# Altium project ST1-1.PrjPcb (part 3 of 5)

## Sheet Output_Terminals.SchDoc: Output Terminals & Voltage detection
size A3; DocumentNumber: 9; SheetNumber: 9; SheetTotal: 20
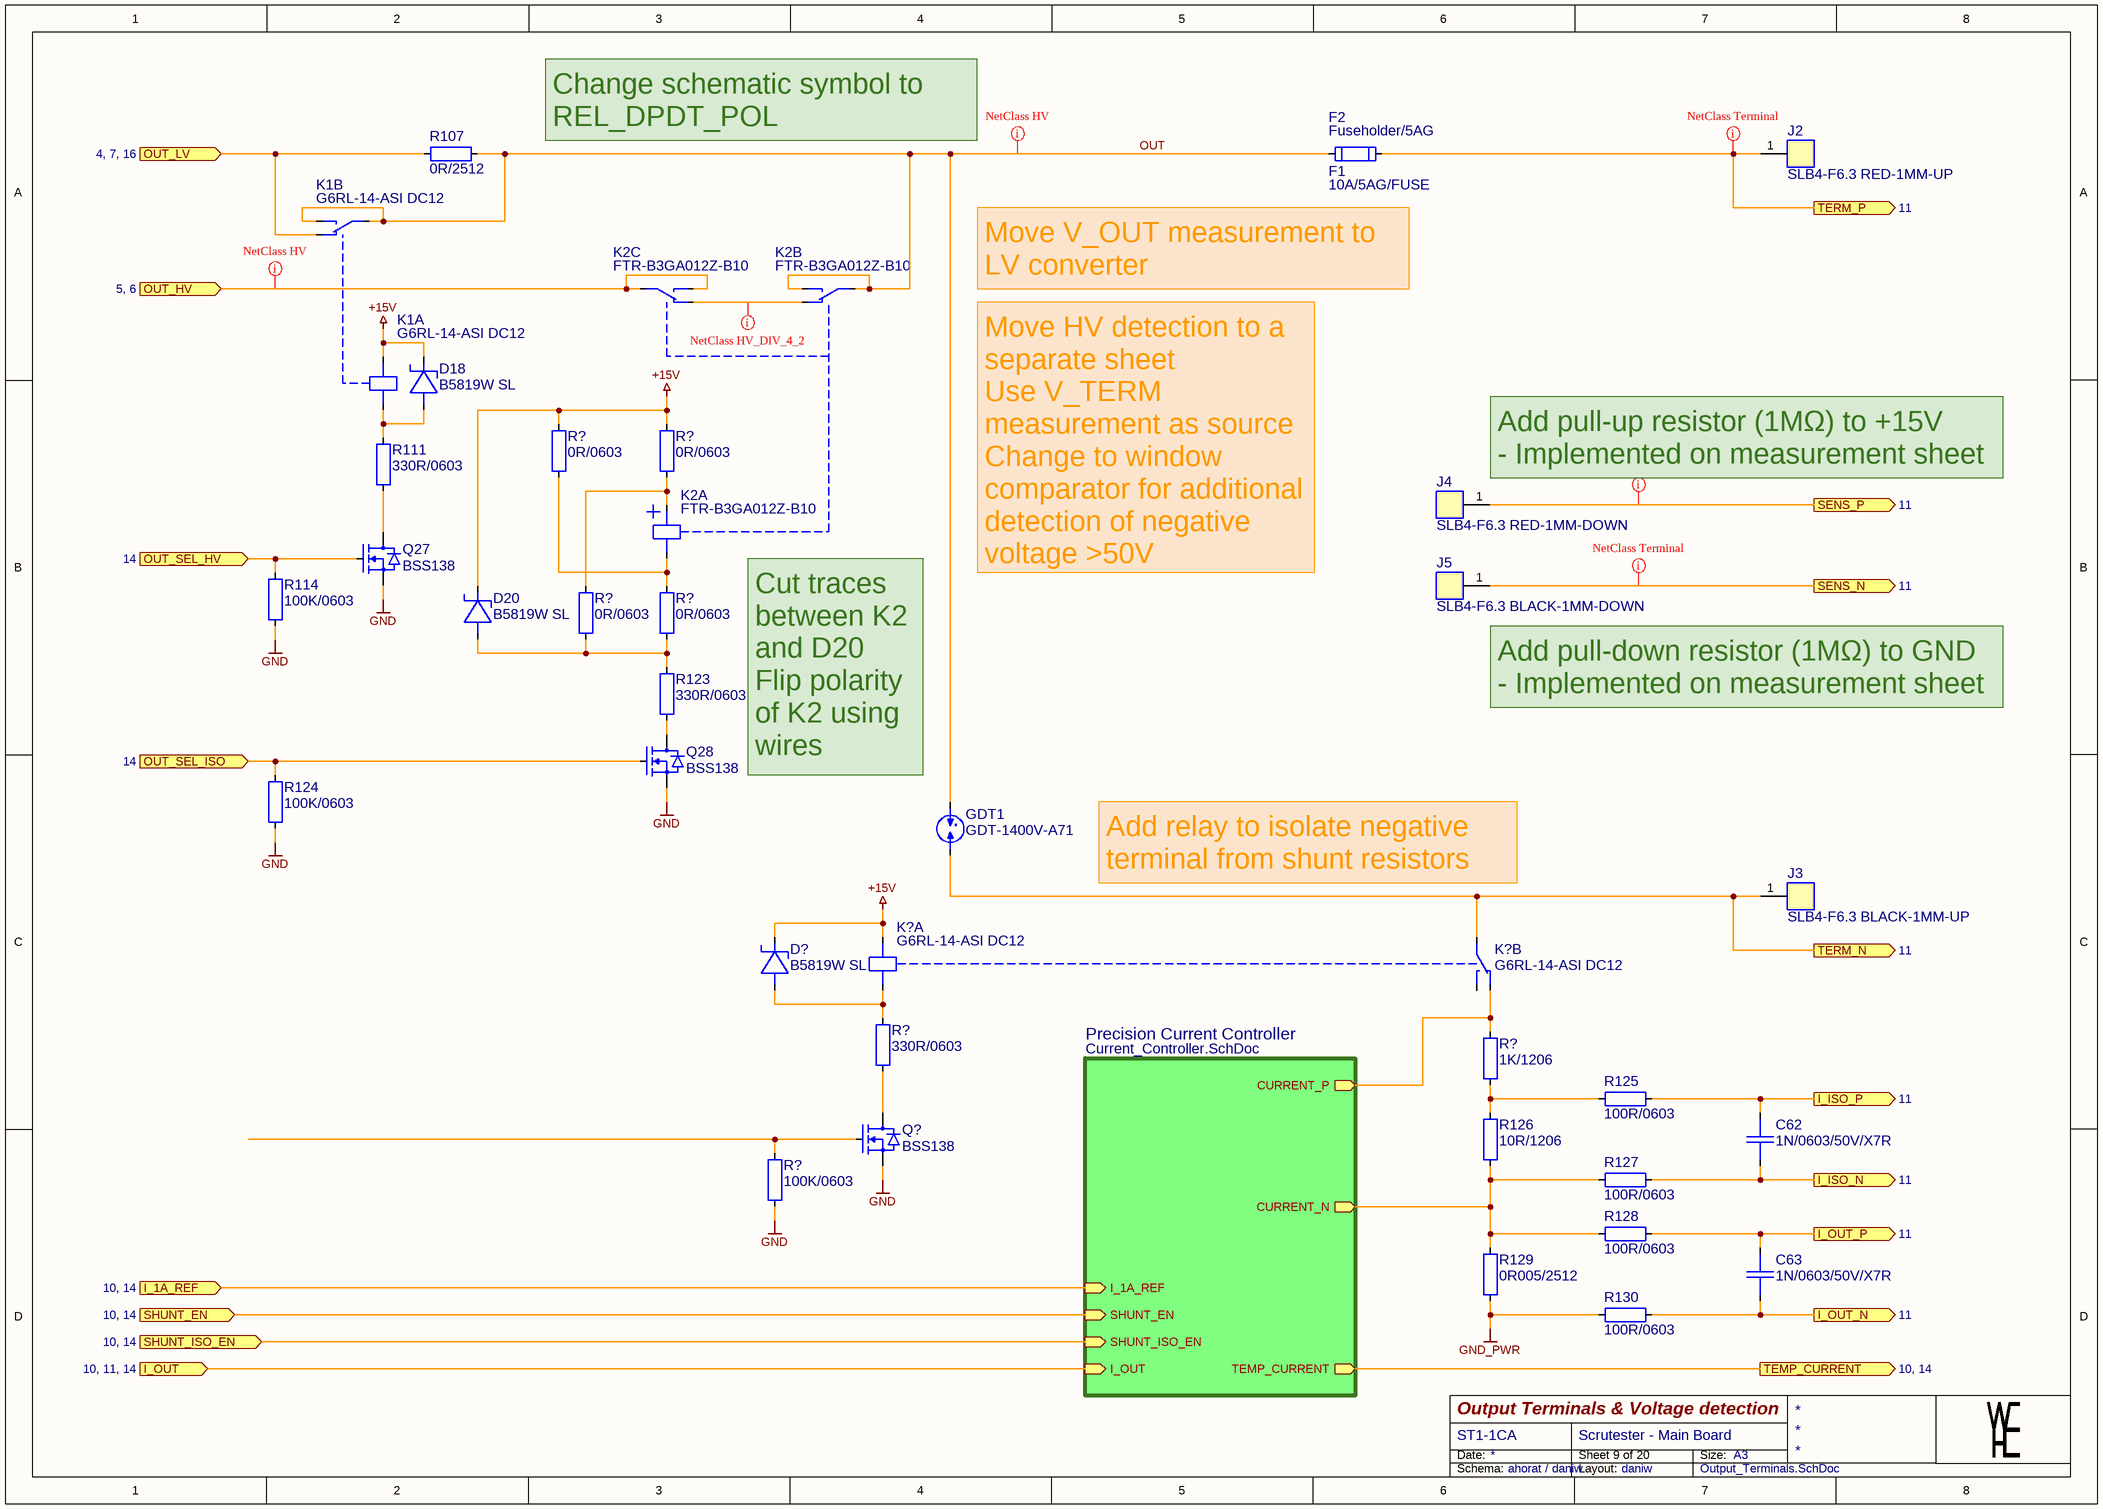
[diagram p6: Output_Terminals.SchDoc]

### Parts
(Parts that share a designator on the sheet are numbered #1, #2 ... from top to bottom, then left to right.)
C62  1N/0603/50V/X7R  [CAP0603_X7R]
C63  1N/0603/50V/X7R  [CAP0603_X7R]
D18  B5819W SL  [SOD3718X125]
D20  B5819W SL  [SOD3718X125]
D?  B5819W SL  [SOD3718X125]
F1  10A/5AG/FUSE  [Fuse_5AG_5mm]
F2  Fuseholder/5AG  [KEYSTONE_3576]
GDT1  GDT-1400V-A71  [GDTAD1200W100L800D800H1200]
J2  SLB4-F6.3 RED-1MM-UP  [SLB4-F6.3-RED]
J3  SLB4-F6.3 BLACK-1MM-UP  [SLB4-F6.3-BLACK]
J4  SLB4-F6.3 RED-1MM-DOWN  [SLB4-F6.3-RED]
J5  SLB4-F6.3 BLACK-1MM-DOWN  [SLB4-F6.3-BLACK]
K1  G6RL-14-ASI DC12  [G6RL-1]  (parts A,B of 2)
K2  FTR-B3GA012Z-B10  [FTR-B3G]  (parts A,B,C of 3)
K?#1  G6RL-14-ASI DC12  [G6RL-1]  (part A of 2)
K?#2  G6RL-14-ASI DC12  [G6RL-1]  (part B of 2)
Q27  BSS138  [SOT2395P280X125-3-SE]
Q28  BSS138  [SOT2395P280X125-3-SE]
Q?#1  BSS138  [SOT2395P280X125-3-SE]
R107  0R/2512  [R2512-0.65-WW]
R111  330R/0603  [R0603-0.40-WW]
R114  100K/0603  [R0603-0.40-WW]
R123  330R/0603  [R0603-0.40-WW]
R124  100K/0603  [R0603-0.40-WW]
R125  100R/0603  [R0603-0.40-WW]
R126  10R/1206  [R1206-0.80-WW]
R127  100R/0603  [R0603-0.40-WW]
R128  100R/0603  [R0603-0.40-WW]
R129  0R005/2512  [R2512-0.65-WW]
R130  100R/0603  [R0603-0.40-WW]
R?#4  0R/0603  [R0603-0.40-WW]
R?#5  0R/0603  [R0603-0.40-WW]
R?#6  0R/0603  [R0603-0.40-WW]
R?#7  0R/0603  [R0603-0.40-WW]
R?#8  330R/0603  [R0603-0.40-WW]
R?#9  1K/1206  [R1206-0.80-WW]
R?#10  100K/0603  [R0603-0.40-WW]

### Sub-sheets
Precision Current Controller = Current_Controller.SchDoc: TEMP_CURRENT (out), CURRENT_P (out), I_OUT (in), SHUNT_ISO_EN (in), SHUNT_EN (in), I_1A_REF (in), CURRENT_N (out)

### Ports
I_1A_REF (in, see 10, 14), I_ISO_N (out, see 11), I_ISO_P (out, see 11), I_OUT (in, see 10, 11, 14), I_OUT_N (out, see 11), I_OUT_P (out, see 11), OUT_HV (in, see 5, 6), OUT_LV (in, see 4, 7, 16), OUT_SEL_HV (in, see 14), OUT_SEL_ISO (in, see 14), SENS_N (out, see 11), SENS_P (out, see 11), SHUNT_EN (in, see 10, 14), SHUNT_ISO_EN (in, see 10, 14), TEMP_CURRENT (out, see 10, 14), TERM_N (out, see 11), TERM_P (out, see 11)

### Nets
+15V: D18.1(C) D20.1(C) D?.1(C) K1.2 K?#1.1 R?#4.1 R?#5.1
GND: Q27.2(SOURCE) Q28.2(SOURCE) Q?#1.2(SOURCE) R114.2 R124.2 R?#10.2
GND_PWR: R129.2 R130.1
I_1A_REF: port I_1A_REF, sheet Precision Current Controller/I_1A_REF
I_ISO_N: C62.2 R127.2 ; port I_ISO_N
I_ISO_P: C62.1 R125.2 ; port I_ISO_P
I_OUT: port I_OUT, sheet Precision Current Controller/I_OUT
I_OUT_N: C63.2 R130.2 ; port I_OUT_N
I_OUT_P: C63.1 R128.2 ; port I_OUT_P
OUT: F2.1 GDT1.1 K1.3(COM1) K1.5(NO1) K2.3(COM1) K2.5(NO1) R107.1
OUT_HV: K2.6(COM2) K2.8(NO2) ; port OUT_HV
OUT_LV: K1.4(NC1) R107.2 ; port OUT_LV
OUT_SEL_HV: Q27.1(GATE) R114.1 ; port OUT_SEL_HV
OUT_SEL_ISO: Q28.1(GATE) R124.1 ; port OUT_SEL_ISO
SENS_N: J5.1 ; port SENS_N
SENS_P: J4.1 ; port SENS_P
SHUNT_EN: port SHUNT_EN, sheet Precision Current Controller/SHUNT_EN
SHUNT_ISO_EN: port SHUNT_ISO_EN, sheet Precision Current Controller/SHUNT_ISO_EN
TEMP_CURRENT: port TEMP_CURRENT, sheet Precision Current Controller/TEMP_CURRENT
TERM_N: GDT1.2 J3.1 K?#2.3(COM1) ; port TERM_N
TERM_P: F2.2 J2.1 ; port TERM_P
NetD18_2: D18.2(A) K1.1 R111.1
NetD20_2: D20.2(A) R123.1 R?#6.2 R?#7.2
NetD?_2: D?.2(A) K?#1.2 R?#8.1
NetK2_1: K2.1 R?#5.2 R?#6.1
NetK2_2: K2.2 R?#4.2 R?#7.1
NetK2_4: K2.4(NC1) K2.7(NC2)
NetK?#2_4: K?#2.4(NC1) R?#9.1 ; sheet Precision Current Controller/CURRENT_P
NetQ27_3: Q27.3(DRAIN) R111.2
NetQ28_3: Q28.3(DRAIN) R123.2
NetQ31_2: R126.2 R127.1 R128.1 R129.1 ; sheet Precision Current Controller/CURRENT_N
NetQ?#1_1: Q?#1.1(GATE) R?#10.1
NetQ?#1_3: Q?#1.3(DRAIN) R?#8.2
NetR125_1: R125.1 R126.1 R?#9.2

Not connected (* = marked no-connect by the designer): K?#2 5(NO1)

### Layout directives
net class HV: OUT, OUT_HV
net class Terminal: SENS_N, SENS_P, TERM_P
net class HV_DIV_4_2: NetK2_4

### Notes on the sheet
- Change schematic symbol to REL_DPDT_POL
- Move V_OUT measurement to LV converter
- (near J4) Add pull-up resistor (1MΩ) to +15V
  - Implemented on measurement sheet
- Move HV detection to a separate sheet
  Use V_TERM measurement as source
  Change to window comparator for additional detection of negative voltage >50V
- (near J5) Add pull-down resistor (1MΩ) to GND
  - Implemented on measurement sheet
- (near GDT1) Cut traces between K2 and D20
  Flip polarity of K2 using wires
- (near GDT1) Alternate relay options:
  - IM06CGR
  (fits on same footprint)
  (reversed coil polarity)
  - IM06JR
  (requires different footprint)
  (coil polarity unverified)
- Add relay to isolate negative terminal from shunt resistors
- Date:
- Size:
- A3
- Schema:
- Layout:

### Library data of the parts
C62 C63 = 1N/0603/50V/X7R: CAP SM 0603 1.0nF 50V X7R; Manufacturer: GENERIC; Manufacturer 1: YAGEO; Manufacturer Part Number 1: CC0603KPX7R9BB102; Absolute Value: 1E-9; Eurocircuits GPN: GPC0603102; Part Number: 1N/0603/50V/X7R; Package: 0603; Value: 1.0nF; HelpURL: https://www.yageo.com/upload/media/product/app/datasheet/mlcc/upy-gphc_x7r_6_3v-to-250v.pdf; Supplier 1: Digi-Key; Supplier Part Number 1: 13-CC0603KPX7R9BB102CT-ND; Manufacturer 2: YAGEO; Manufacturer Part Number 2: CC0603KRX7R9BB102; Supplier 2: Digi-Key; Supplier Part Number 2: 311-1080-1-ND; JLC Type: Basic; Manufacturer Part Number 3: CL10B102KB8NNNC; Supplier 3: LCSC; Supplier Part Number 3: C1588
D18 D20 D? = B5819W SL: 40V 600mV@1A 1A SOD-123 Schottky Barrier Diodes; Manufacturer: GENERIC; Manufacturer 1: SMC Diode Solutions; Part Number: B5819W SL; Package: SOD-123; Value: B5819W SL; Absolute Value: 40V; HelpURL: https://datasheet.lcsc.com/lcsc/2304140030_Jiangsu-Changjing-Electronics-Technology-Co---Ltd--B5819W-SL_C8598.pdf; Manufacturer Part Number 1: B5819WSL; Supplier 1: Digikey; Supplier Part Number 1: 1655-B5819WSLCT-ND; Manufacturer 3: Jiangsu Changjing Electronics Technology Co., Ltd.; Manufacturer Part Number 3: B5819W SL; Supplier 3: LCSC; Supplier Part Number 3: C8598; JLC Type: Basic
F1 = 10A/5AG/FUSE: Fuse 1000V AC/DC 10A 5AG 10.3x38mm; Manufacturer: Phoenix Contact; Manufacturer Part Number 1: 3061334; Part Number: 10A/5AG/FUSE; Package: 5AG; Value: 10A; HelpURL: https://www.phoenixcontact.com/us/products/3061334/pdf; Manufacturer 1: Phoenix Contact; Supplier 1: Digi-Key; Supplier Part Number 1: 277-15212-ND
F2 = Fuseholder/5AG: Manufacturer 1: Keystone Electronics; Manufacturer Part Number 1: 3576; Part Number: Fuseholder/5AG; Supplier 1: Digi-Key; Supplier Part Number 1: 36-3576-ND; HelpURL: https://www.keyelco.com/product-pdf.cfm?p=347; Package: 5AG; Manufacturer 2: Keystone Electronics; Manufacturer Part Number 2: 3576; Supplier 2: Mouser; Supplier Part Number 2: 534-3576
GDT1 = GDT-1400V-A71-12MM-4MM: 2-electrode surge arrester, 1400V, 10kA, A71 series, 12mm lead spacing, 4mm standoff height; Manufacturer: TDK; Manufacturer 1: EPCOS - TDK Electronics; Manufacturer Part Number 1: B88069X2180S102; Absolute Value: 1400; Part Number: GDT-1400V-A71-12MM-4MM; Package: Axial; Value: 1400V; HelpURL: https://www.tdk-electronics.tdk.com/inf/100/ds/A71-H14X-X2180S102.pdf; Supplier 1: Digi-Key; Supplier Part Number 1: 495-4270-ND; Manufacturer 2: EPCOS - TDK Electronics; Manufacturer Part Number 2: B88069X3500T502; Supplier 2: Digi-Key; Supplier Part Number 2: 495-5911-1-ND
J2 = SLB4-F6.3 RED-1MM-UP: SLB4-F6.3 Insulated, rigid, Ø 4 mm, accepting spring-loaded Ø 4 mm plugs with rigid insulating sleeve. Machined brass. Insulation material UL94 V-0. The socket is screwed into pre-drilled panels of plastic, metal, etc. Flat connecting tab 6.3 mm x 0.8 mm.; Manufacturer: Stäubli; Manufacturer 1: Stäubli Electrical Connectors; Manufacturer Part Number 1: 23.3060-22; System: Connector; Part Number: SLB4-F6.3 RED-1MM-UP; HelpURL: https://www.staubli.com/content/dam/ecs/technical-documentation/datasheets/TM/23.3060_en.pdf; Supplier 1: Distrelec; Supplier Part Number 1: 30136218
J3 = SLB4-F6.3 BLACK-1MM-UP: SLB4-F6.3 Insulated, rigid, Ø 4 mm, accepting spring-loaded Ø 4 mm plugs with rigid insulating sleeve. Machined brass. Insulation material UL94 V-0. The socket is screwed into pre-drilled panels of plastic, metal, etc. Flat connecting tab 6.3 mm x 0.8 mm.; Manufacturer: Stäubli; Manufacturer 1: Stäubli Electrical Connectors; Manufacturer Part Number 1: 23.3060-21; System: Connector; Part Number: SLB4-F6.3 BLACK-1MM-UP; HelpURL: https://www.staubli.com/content/dam/ecs/technical-documentation/datasheets/TM/23.3060_en.pdf; Supplier 1: Distrelec; Supplier Part Number 1: 30136217
J4 = SLB4-F6.3 RED-1MM-DOWN: SLB4-F6.3 Insulated, rigid, Ø 4 mm, accepting spring-loaded Ø 4 mm plugs with rigid insulating sleeve. Machined brass. Insulation material UL94 V-0. The socket is screwed into pre-drilled panels of plastic, metal, etc. Flat connecting tab 6.3 mm x 0.8 mm.; Manufacturer: Stäubli; Manufacturer 1: Stäubli Electrical Connectors; Manufacturer Part Number 1: 23.3060-22; System: Connector; Part Number: SLB4-F6.3 RED-1MM-DOWN; HelpURL: https://www.staubli.com/content/dam/ecs/technical-documentation/datasheets/TM/23.3060_en.pdf; Supplier 1: Distrelec; Supplier Part Number 1: 30136218
J5 = SLB4-F6.3 BLACK-1MM-DOWN: SLB4-F6.3 Insulated, rigid, Ø 4 mm, accepting spring-loaded Ø 4 mm plugs with rigid insulating sleeve. Machined brass. Insulation material UL94 V-0. The socket is screwed into pre-drilled panels of plastic, metal, etc. Flat connecting tab 6.3 mm x 0.8 mm.; Manufacturer: Stäubli; Manufacturer 1: Stäubli Electrical Connectors; Manufacturer Part Number 1: 23.3060-21; System: Connector; Part Number: SLB4-F6.3 BLACK-1MM-DOWN; HelpURL: https://www.staubli.com/content/dam/ecs/technical-documentation/datasheets/TM/23.3060_en.pdf; Supplier 1: Distrelec; Supplier Part Number 1: 30136217
K1 K?#1 K?#2 = G6RL-14-ASI DC12: RELAY GEN PURPOSE SPDT 8A 12V; Manufacturer: Omron Electronics Inc-EMC Div; Part Number: G6RL-14-ASI DC12; HelpURL: https://omronfs.omron.com/en_US/ecb/products/pdf/en-g6rl.pdf; Manufacturer 1: Omron Electronics Inc-EMC Div; Manufacturer Part Number 1: G6RL-14-ASI DC12; Supplier 1: Digi-Key; Supplier Part Number 1: 39-G6RL-14-ASIDC12-ND
K2 = FTR-B3GA012Z-B10: FTR-B3 Series Ultra Miniature Relay 2 Poles - 2 A (Low Profile Signal Relay); Manufacturer: Fujitsu; Part Number: FTR-B3GA012Z-B10; HelpURL: https://www.fujitsu.com/sg/imagesgig5/ftr-b3.pdf; Manufacturer 3: FUJITSU; Manufacturer Part Number 3: FTR-B3GA012Z-B10; Supplier 3: LCSC; Supplier Part Number 3: C2992429; JLC Type: Extended
Q27 Q28 Q?#1 = BSS138: N-Kanal 50 V 220mA (Ta) 350mW (Ta) Oberflächenmontage SOT-23; Manufacturer: GENERIC; Manufacturer 1: ANBON SEMICONDUCTOR (INT'L) LIMITED; Part Number: BSS138; Package: SOT23; HelpURL: https://mm.digikey.com/Volume0/opasdata/d220001/medias/docus/3037/BSS138.pdf; Manufacturer Part Number 1: BSS138; Supplier 1: Digi-Key; Supplier Part Number 1: 4530-BSS138CT-ND; Manufacturer 3: FOSAN; Manufacturer Part Number 3: BSS138; Supplier 3: LCSC; Supplier Part Number 3: C2926186; JLC Type: Extended; Manufacturer 2: FOSAN; Manufacturer Part Number 2: BSS138; Supplier 2: LCSC; Supplier Part Number 2: C2926186
R107 = 0R/2512: RES SM 2512 0R; Manufacturer: GENERIC; Absolute Value: 0; Part Number: 0R/2512; Package: 2512; Value: 0R
R111 R123 R?#8 = 330R/0603: RES SM 0603 330R; Manufacturer: GENERIC; Manufacturer 1: YAGEO; Manufacturer Part Number 1: RC0603FR-13330RL; Absolute Value: 330; Eurocircuits GPN: GPR0603330R; Part Number: 330R/0603; Package: 0603; Value: 330R; HelpURL: https://www.yageogroup.com/content/datasheet/asset/file/PYU-RC_GROUP_51_ROHS_L; Supplier 1: Digi-Key; Supplier Part Number 1: 13-RC0603FR-13330RLCT-ND; Manufacturer 2: YAGEO; Manufacturer Part Number 2: RC0603FR-10330RL; Supplier 2: Digi-Key; Supplier Part Number 2: 13-RC0603FR-10330RLCT-ND; Manufacturer 3: UNI-ROYAL(Uniroyal Elec); Manufacturer Part Number 3: 0603WAF3300T5E; Supplier 3: LCSC; Supplier Part Number 3: C23138; JLC Type: Basic
R114 R124 R?#10 = 100K/0603: RES SM 0603 100K; Manufacturer: GENERIC; Manufacturer 1: YAGEO; Manufacturer Part Number 1: RC0603FR-13100KL; Absolute Value: 100000; Eurocircuits GPN: GPR0603100K; Part Number: 100K/0603; Package: 0603; Value: 100K; HelpURL: https://www.yageogroup.com/content/datasheet/asset/file/PYU-RC_GROUP_51_ROHS_L; Supplier 1: Digi-Key; Supplier Part Number 1: 13-RC0603FR-13100KLCT-ND; Manufacturer 2: YAGEO; Manufacturer Part Number 2: RC0603FR-10100KL; Supplier 2: Digi-Key; Supplier Part Number 2: 13-RC0603FR-10100KLCT-ND; Manufacturer 3: UNI-ROYAL(Uniroyal Elec); Manufacturer Part Number 3: 0603WAF1003T5E; Supplier 3: LCSC; Supplier Part Number 3: C25803; JLC Type: Basic
R125 R127 R128 R130 = 100R/0603: RES SM 0603 100R; Manufacturer: GENERIC; Manufacturer 1: YAGEO; Manufacturer Part Number 1: RC0603FR-13100RL; Absolute Value: 100; Eurocircuits GPN: GPR0603100R; Part Number: 100R/0603; Package: 0603; Value: 100R; HelpURL: https://www.yageogroup.com/content/datasheet/asset/file/PYU-RC_GROUP_51_ROHS_L; Supplier 1: Digi-Key; Supplier Part Number 1: 13-RC0603FR-13100RLCT-ND; Manufacturer 2: YAGEO; Manufacturer Part Number 2: RC0603FR-10100RL; Supplier 2: Digi-Key; Supplier Part Number 2: 13-RC0603FR-10100RLCT-ND; Manufacturer 3: UNI-ROYAL(Uniroyal Elec); Manufacturer Part Number 3: 0603WAF1000T5E; Supplier 3: LCSC; Supplier Part Number 3: C22775
R126 = 10R/1206: RES SM 1206 10R; Manufacturer: GENERIC; Absolute Value: 10; Part Number: 10R/1206; Package: 1206; Value: 10R
R129 = 0R005/2512: RES SM 2512 0R005; Manufacturer: GENERIC; Manufacturer 1: Ohmite; Manufacturer Part Number 1: MCS3264R005FER; Absolute Value: 0.005; Part Number: 0R005/2512; Package: 2512; Value: 0R005; HelpURL: https://www.ohmite.com/assets/docs/res_mcs.pdf?r=false; Supplier 1: Digi-Key; Supplier Part Number 1: MCS3264R005FERCT-ND; Manufacturer 3: prosemi; Manufacturer Part Number 3: LMP25MF2P0R005; Supplier 3: LCSC; Supplier Part Number 3: C2937402
R?#4-R?#7 = 0R/0603: RES SM 0603 0R; Manufacturer: GENERIC; Manufacturer 1: YAGEO; Manufacturer Part Number 1: RC0603FR-070RL; Absolute Value: 0; Eurocircuits GPN: GPR06030R; Part Number: 0R/0603; Package: 0603; Value: 0R; HelpURL: https://www.yageogroup.com/content/datasheet/asset/file/PYU-RC_GROUP_51_ROHS_L; Supplier 1: Digi-Key; Supplier Part Number 1: 311-0.0HRCT-ND; Manufacturer 2: YAGEO; Manufacturer Part Number 2: RC0603FR-130RL; Supplier 2: Digi-Key; Supplier Part Number 2: 13-RC0603FR-130RLCT-ND; Manufacturer 3: UNI-ROYAL(Uniroyal Elec); Manufacturer Part Number 3: 0603WAF0000T5E; Supplier 3: LCSC; Supplier Part Number 3: C21189; JLC Type: Basic
R?#9 = 1K/1206: RES SM 1206 1K; Manufacturer: GENERIC; Absolute Value: 1000; Part Number: 1K/1206; Package: 1206; Value: 1K

## Sheet Current_Controller.SchDoc: Precision Current source
size A3; DocumentNumber: 10; SheetNumber: 10; SheetTotal: 20
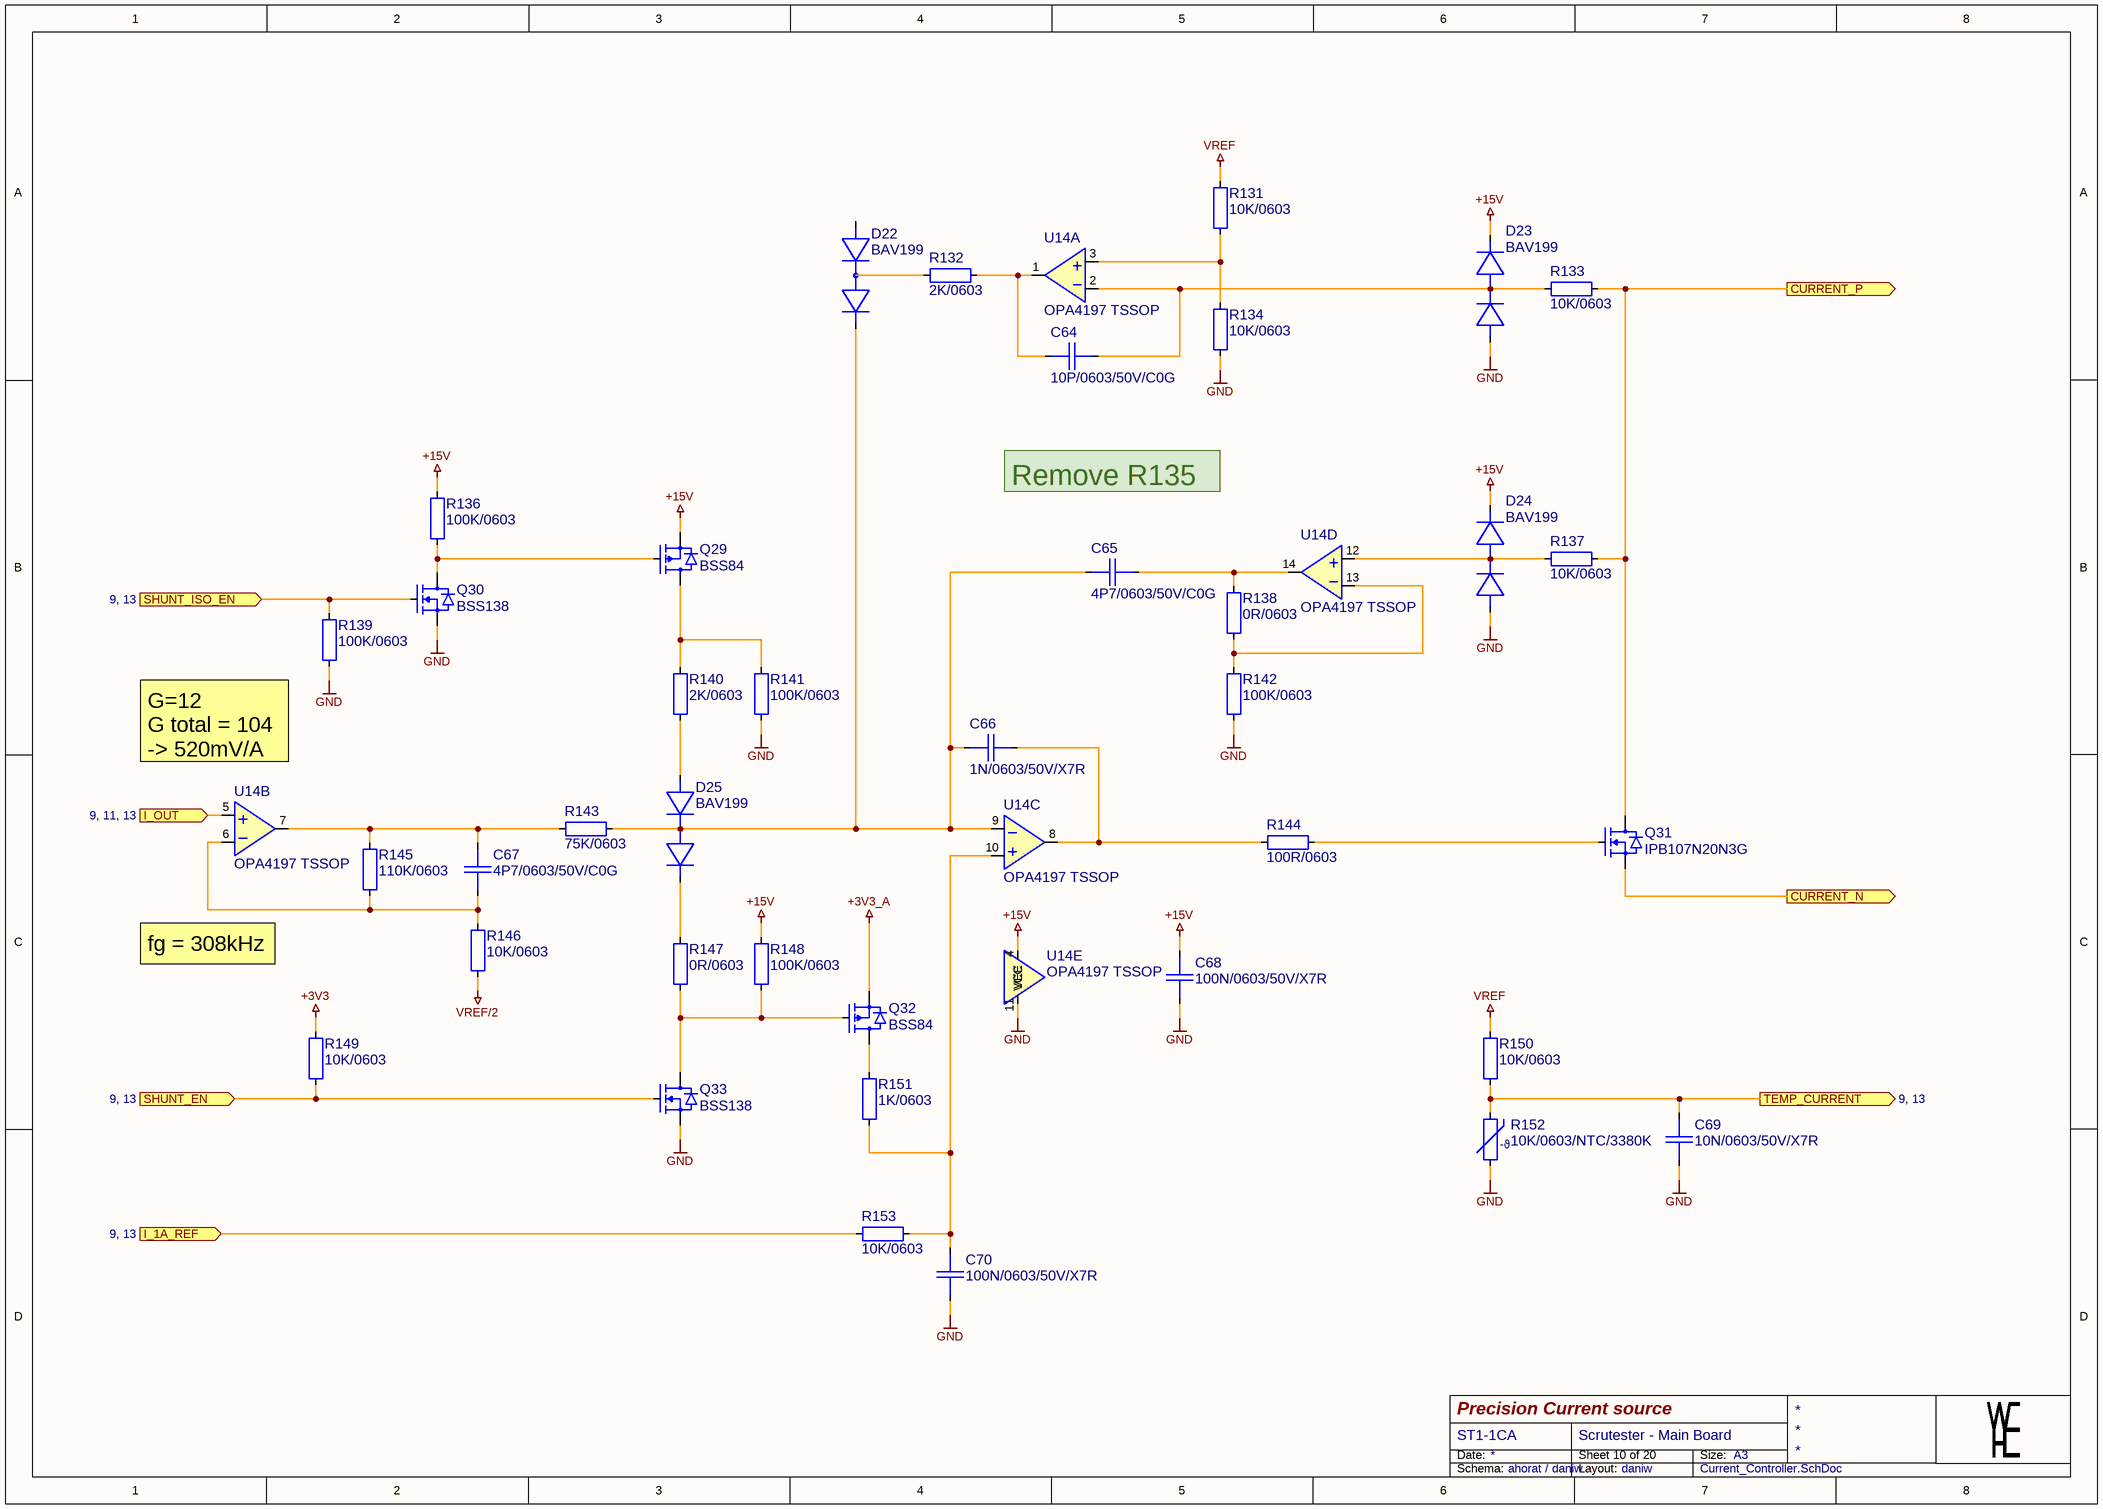
[diagram p7: Current_Controller.SchDoc]

### Parts
C64  10P/0603/50V/C0G  [CAP0603_C0G]
C65  4P7/0603/50V/C0G  [CAP0603_C0G]
C66  1N/0603/50V/X7R  [CAP0603_X7R]
C67  4P7/0603/50V/C0G  [CAP0603_C0G]
C68  100N/0603/50V/X7R  [CAP0603_X7R]
C69  10N/0603/50V/X7R  [CAP0603_X7R]
C70  100N/0603/50V/X7R  [CAP0603_X7R]
D22  BAV199  [SOT2395P280X125-3-SE]
D23  BAV199  [SOT2395P280X125-3-SE]
D24  BAV199  [SOT2395P280X125-3-SE]
D25  BAV199  [SOT2395P280X125-3-SE]
Q29  BSS84  [SOT2395P280X125-3-SE]
Q30  BSS138  [SOT2395P280X125-3-SE]
Q31  IPB107N20N3G  [TO254P1530X1035-3]
Q32  BSS84  [SOT2395P280X125-3-SE]
Q33  BSS138  [SOT2395P280X125-3-SE]
R131  10K/0603  [R0603-0.40-WW]
R132  2K/0603  [R0603-0.40-WW]
R133  10K/0603  [R0603-0.40-WW]
R134  10K/0603  [R0603-0.40-WW]
R136  100K/0603  [R0603-0.40-WW]
R137  10K/0603  [R0603-0.40-WW]
R138  0R/0603  [R0603-0.40-WW]
R139  100K/0603  [R0603-0.40-WW]
R140  2K/0603  [R0603-0.40-WW]
R141  100K/0603  [R0603-0.40-WW]
R142  100K/0603  [R0603-0.40-WW]
R143  75K/0603  [R0603-0.40-WW]
R144  100R/0603  [R0603-0.40-WW]
R145  110K/0603  [R0603-0.40-WW]
R146  10K/0603  [R0603-0.40-WW]
R147  0R/0603  [R0603-0.40-WW]
R148  100K/0603  [R0603-0.40-WW]
R149  10K/0603  [R0603-0.40-WW]
R150  10K/0603  [R0603-0.40-WW]
R151  1K/0603  [R0603-0.40-WW]
R152  10K/0603/NTC/3380K  [R0603-0.40-WW]
R153  10K/0603  [R0603-0.40-WW]
U14  OPA4197 TSSOP  [SOP065P640X120-14NW]  (parts A,B,C,D,E of 5)

### Ports
CURRENT_N (out), CURRENT_P (out), I_1A_REF (in, see 9, 13), I_OUT (in, see 9, 11, 13), SHUNT_EN (in, see 9, 13), SHUNT_ISO_EN (in, see 9, 13), TEMP_CURRENT (out, see 9, 13)

### Nets
+3V3: R149.1
+3V3_A: Q32.2(SOURCE)
+15V: C68.1 D23.2(K2) D24.2(K2) Q29.2(SOURCE) R136.1 R148.1 U14.4(VCC)
GND: C68.2 C69.2 C70.2 D23.1(A1) D24.1(A1) Q30.2(SOURCE) Q33.2(SOURCE) R134.2 R139.2 R141.2 R142.2 R152.2 U14.11(VEE)
VREF: R131.1 R150.1
VREF/2: R146.2
I_1A_REF: R153.1 ; port I_1A_REF
I_OUT: U14.5(IN+) ; port I_OUT
SHUNT_EN: Q33.1(GATE) R149.2 ; port SHUNT_EN
SHUNT_ISO_EN: Q30.1(GATE) R139.1 ; port SHUNT_ISO_EN
TEMP_CURRENT: C69.1 R150.2 R152.1 ; port TEMP_CURRENT
NetC64_1: C64.1 R132.1 U14.1(OUT)
NetC64_2: C64.2 D23.3(K1/A2) R133.1 U14.2(IN-)
NetC65_1: C65.1 C66.1 D22.2(K2) D25.3(K1/A2) R143.2 U14.9(IN-)
NetC65_2: C65.2 R138.1 U14.14(OUT)
NetC66_2: C66.2 R144.1 U14.8(OUT)
NetC67_1: C67.1 R143.1 R145.1 U14.7(OUT)
NetC67_2: C67.2 R145.2 R146.1 U14.6(IN-)
NetC70_1: C70.1 R151.2 R153.2 U14.10(IN+)
NetD22_3: D22.3(K1/A2) R132.2
NetD24_3: D24.3(K1/A2) R137.1 U14.12(IN+)
NetD25_1: D25.1(A1) R140.2
NetD25_2: D25.2(K2) R147.1
NetK?#2_4: Q31.3(DRAIN) R133.2 R137.2 ; port CURRENT_P
NetQ29_1: Q29.1(GATE) Q30.3(DRAIN) R136.2
NetQ29_3: Q29.3(DRAIN) R140.1 R141.1
NetQ31_1: Q31.1(GATE) R144.2
NetQ31_2: Q31.2(SOURCE) ; port CURRENT_N
NetQ32_1: Q32.1(GATE) Q33.3(DRAIN) R147.2 R148.2
NetQ32_3: Q32.3(DRAIN) R151.1
NetR131_2: R131.2 R134.1 U14.3(IN+)
NetR138_2: R138.2 R142.1 U14.13(IN-)

Not connected (* = marked no-connect by the designer): D22 1(A1)

### Notes on the sheet
- Remove R135
- G=12
  G total = 104
  -> 520mV/A
- fg = 308kHz
- Date:
- Size:
- A3
- Schema:
- Layout:
- (in symbol 10K/0603/NTC/3380K) -ϑ

### Library data of the parts
C64 = 10P/0603/50V/C0G: CAP SM 0603 10pF 50V C0G; Manufacturer: GENERIC; Manufacturer 1: YAGEO; Manufacturer Part Number 1: CC0603JRNPO9BN100; Absolute Value: 1E-11; Eurocircuits GPN: GPC0603100-C0G; Part Number: 10P/0603/50V/C0G; Package: 0603; Value: 10pF; HelpURL: https://www.yageo.com/upload/media/product/productsearch/datasheet/mlcc/UPY-GP_NP0_16V-to-50V_18.pdf; Supplier 1: Digi-Key; Supplier Part Number 1: 311-1058-1-ND; Manufacturer 2: YAGEO; Manufacturer Part Number 2: CC0603KRNPO9BN100; Supplier 2: Digi-Key; Supplier Part Number 2: 311-4025-1-ND; Manufacturer Part Number 3: CL10C100JB8NNNC; Supplier 3: LCSC; Supplier Part Number 3: C1634
C65 C67 = 4P7/0603/50V/C0G: CAP SM 0603 4.7pF 50V C0G; Manufacturer: GENERIC; Manufacturer 1: YAGEO; Manufacturer Part Number 1: CC0603CRNPO9BN4R7; Absolute Value: 4.7E-12; Eurocircuits GPN: GPC06034R7-C0G; Part Number: 4P7/0603/50V/C0G; Package: 0603; Value: 4.7pF; HelpURL: https://www.yageo.com/upload/media/product/productsearch/datasheet/mlcc/UPY-GP_NP0_16V-to-50V_18.pdf; Supplier 1: Digi-Key; Supplier Part Number 1: 311-1740-1-ND; Manufacturer 2: YAGEO; Manufacturer Part Number 2: CC0603DRNPO9BN4R7; Supplier 2: Digi-Key; Supplier Part Number 2: 13-CC0603DRNPO9BN4R7CT-ND; Manufacturer Part Number 3: CGA0603C0G4R7C500JT; Supplier 3: LCSC; Supplier Part Number 3: C41361238
C66 = 1N/0603/50V/X7R: as C62 on sheet Output_Terminals; Part Number: 1N/0603/50V/X7R; Package: 0603; Value: 1.0nF; HelpURL: https://www.yageo.com/upload/media/product/app/datasheet/mlcc/upy-gphc_x7r_6_3v-to-250v.pdf; Supplier 1: Digi-Key; Supplier Part Number 1: 13-CC0603KPX7R9BB102CT-ND; Manufacturer 2: YAGEO; Manufacturer Part Number 2: CC0603KRX7R9BB102; Supplier 2: Digi-Key; Supplier Part Number 2: 311-1080-1-ND; Manufacturer Part Number 3: CL10B102KB8NNNC; Supplier 3: LCSC; Supplier Part Number 3: C1588; JLC Type: Basic
C68 C70 = 100N/0603/50V/X7R: CAP SM 0603 100nF 50V X7R; Manufacturer: GENERIC; Manufacturer 1: YAGEO; Manufacturer Part Number 1: CC0603KPX7R9BB104; Absolute Value: 1E-7; Eurocircuits GPN: GPC0603104; Part Number: 100N/0603/50V/X7R; Package: 0603; Value: 100nF; HelpURL: https://www.yageo.com/upload/media/product/app/datasheet/mlcc/upy-gphc_x7r_6_3v-to-250v.pdf; Supplier 1: Digi-Key; Supplier Part Number 1: 311-3567-1-ND; Supplier 3: LCSC; Supplier Part Number 3: C14663; Manufacturer 2: YAGEO; Manufacturer Part Number 2: CC0603MRX7R9BB104; Supplier 2: Digi-Key; Supplier Part Number 2: 311-4110-1-ND; JLC Type: Basic; Manufacturer Part Number 3: CC0603KRX7R9BB104
C69 = 10N/0603/50V/X7R: CAP SM 0603 10nF 50V X7R; Manufacturer: GENERIC; Manufacturer 1: YAGEO; Manufacturer Part Number 1: CC0603KPX7R9BB103; Absolute Value: 1E-8; Eurocircuits GPN: GPC0603103; Part Number: 10N/0603/50V/X7R; Package: 0603; Value: 10nF; HelpURL: https://www.yageo.com/upload/media/product/app/datasheet/mlcc/upy-gphc_x7r_6_3v-to-250v.pdf; Supplier 1: Digi-Key; Supplier Part Number 1: 311-1572-1-ND; Manufacturer 2: YAGEO; Manufacturer Part Number 2: CC0603KRX7R9BB103; Supplier 2: Digi-Key; Supplier Part Number 2: 311-1085-1-ND; Manufacturer Part Number 3: CC0603KRX7R9BB103; Supplier 3: LCSC; Supplier Part Number 3: C100042
D22-D25 = BAV199: Silicon Low Leakage Diode 85V; Manufacturer: Infineon Technologies; Manufacturer Part Number 1: BAV199E6433HTMA1; Part Number: BAV199; Package: SOT23; Value: BAV199; Absolute Value: 85V; HelpURL: https://www.infineon.com/dgdl/bav199series.pdf?folderId=db3a30431400ef6801141c748874044e&fileId=db3a30431400ef6801141cba733104e5; Manufacturer 1: Infineon Technologies; Supplier 1: Digikey; Supplier Part Number 1: BAV199E6433HTMA1CT-ND; Manufacturer 3: LRC; Manufacturer Part Number 3: LBAV199LT1G; Supplier 3: LCSC; Supplier Part Number 3: C12740
Q29 Q32 = BSS84: 50V P-Channel MOSFET; Manufacturer: GENERIC; Manufacturer 1: Good-Ark Semiconductor; Part Number: BSS84; Package: SOT23; HelpURL: https://goodarksemi.com/docs/datasheets/mosfets/BSS84.pdf; Manufacturer Part Number 1: BSS84; Supplier 1: Digi-Key; Supplier Part Number 1: 4786-BSS84CT-ND; Manufacturer 3: Jiangsu Changjing Electronics Technology Co., Ltd.; Manufacturer Part Number 3: BSS84; Supplier 3: LCSC; Supplier Part Number 3: C114481; JLC Type: Extended; Manufacturer 2: LRC; Manufacturer Part Number 2: LBSS84LT1G; Supplier 2: LCSC; Supplier Part Number 2: C8492
Q30 Q33 = BSS138: as Q27 on sheet Output_Terminals; Part Number: BSS138; Package: SOT23; HelpURL: https://mm.digikey.com/Volume0/opasdata/d220001/medias/docus/3037/BSS138.pdf; Manufacturer Part Number 1: BSS138; Supplier 1: Digi-Key; Supplier Part Number 1: 4530-BSS138CT-ND; Manufacturer 3: FOSAN; Manufacturer Part Number 3: BSS138; Supplier 3: LCSC; Supplier Part Number 3: C2926186; JLC Type: Extended; Manufacturer 2: FOSAN; Manufacturer Part Number 2: BSS138; Supplier 2: LCSC; Supplier Part Number 2: C2926186
Q31 = IPB107N20N3G: 200V 88A 300W 10.7mΩ@10V,88A 4V 1 N-channel TO-263-3 MOSFETs ROHS; Manufacturer: Infineon Technologies; Manufacturer Part Number 1: IPB107N20N3GATMA1CT-ND; Part Number: IPB107N20N3G; Package: TO-263; HelpURL: https://www.infineon.com/dgdl/IPP_I_110N20N3+G_IPB107N20N3+G+Rev2.2.pdf?folderId=db3a3043163797a6011637d4bae7003b&fileId=db3a3043243b5f170124968e7d1f18e7; Manufacturer 1: Infineon Technologies; Supplier 1: Digi-Key; Supplier Part Number 1: IPB107N20N3GATMA1; Manufacturer 3: Infineon Technologies; Manufacturer Part Number 3: IPB107N20N3G; Supplier 3: LCSC; Supplier Part Number 3: C444895
R131 R133 R134 R137 R146 R149 R150 R153 = 10K/0603: RES SM 0603 10K; Manufacturer: GENERIC; Manufacturer 1: YAGEO; Manufacturer Part Number 1: RC0603FR-1310KL; Absolute Value: 10000; Eurocircuits GPN: GPR060310K; Part Number: 10K/0603; Package: 0603; Value: 10K; HelpURL: https://www.yageogroup.com/content/datasheet/asset/file/PYU-RC_GROUP_51_ROHS_L; Supplier 1: Digi-Key; Supplier Part Number 1: 13-RC0603FR-1310KLCT-ND; Manufacturer 2: YAGEO; Manufacturer Part Number 2: RC0603FR-1010KL; Supplier 2: Digi-Key; Supplier Part Number 2: 13-RC0603FR-1010KLCT-ND; Manufacturer 3: UNI-ROYAL(Uniroyal Elec); Manufacturer Part Number 3: 0603WAF1002T5E; Supplier 3: LCSC; Supplier Part Number 3: C25804; JLC Type: Basic
R132 R140 = 2K/0603: RES SM 0603 2K; Manufacturer: GENERIC; Manufacturer 1: YAGEO; Manufacturer Part Number 1: RC0603FR-132KL; Absolute Value: 2000; Eurocircuits GPN: GPR06032K; Part Number: 2K/0603; Package: 0603; Value: 2K; HelpURL: https://www.yageogroup.com/content/datasheet/asset/file/PYU-RC_GROUP_51_ROHS_L; Supplier 1: Digi-Key; Supplier Part Number 1: 13-RC0603FR-132KLCT-ND; Manufacturer 2: YAGEO; Manufacturer Part Number 2: RC0603FR-102KL; Supplier 2: Digi-Key; Supplier Part Number 2: 13-RC0603FR-102KLCT-ND; Manufacturer 3: UNI-ROYAL(Uniroyal Elec); Manufacturer Part Number 3: 0603WAF2001T5E; Supplier 3: LCSC; Supplier Part Number 3: C22975; JLC Type: Basic
R136 R139 R141 R142 R148 = 100K/0603: as R114 on sheet Output_Terminals; Part Number: 100K/0603; Package: 0603; Value: 100K; HelpURL: https://www.yageogroup.com/content/datasheet/asset/file/PYU-RC_GROUP_51_ROHS_L; Supplier 1: Digi-Key; Supplier Part Number 1: 13-RC0603FR-13100KLCT-ND; Manufacturer 2: YAGEO; Manufacturer Part Number 2: RC0603FR-10100KL; Supplier 2: Digi-Key; Supplier Part Number 2: 13-RC0603FR-10100KLCT-ND; Manufacturer 3: UNI-ROYAL(Uniroyal Elec); Manufacturer Part Number 3: 0603WAF1003T5E; Supplier 3: LCSC; Supplier Part Number 3: C25803; JLC Type: Basic
R138 R147 = 0R/0603: as R?#4-R?#7 on sheet Output_Terminals; Part Number: 0R/0603; Package: 0603; Value: 0R; HelpURL: https://www.yageogroup.com/content/datasheet/asset/file/PYU-RC_GROUP_51_ROHS_L; Supplier 1: Digi-Key; Supplier Part Number 1: 311-0.0HRCT-ND; Manufacturer 2: YAGEO; Manufacturer Part Number 2: RC0603FR-130RL; Supplier 2: Digi-Key; Supplier Part Number 2: 13-RC0603FR-130RLCT-ND; Manufacturer 3: UNI-ROYAL(Uniroyal Elec); Manufacturer Part Number 3: 0603WAF0000T5E; Supplier 3: LCSC; Supplier Part Number 3: C21189; JLC Type: Basic
R143 = 75K/0603: RES SM 0603 75K; Manufacturer: GENERIC; Manufacturer 1: YAGEO; Manufacturer Part Number 1: RC0603FR-1375KL; Absolute Value: 75000; Eurocircuits GPN: GPR060375K; Part Number: 75K/0603; Package: 0603; Value: 75K; HelpURL: https://www.yageogroup.com/content/datasheet/asset/file/PYU-RC_GROUP_51_ROHS_L; Supplier 1: Digi-Key; Supplier Part Number 1: 13-RC0603FR-1375KLCT-ND; Manufacturer 2: YAGEO; Manufacturer Part Number 2: RC0603FR-1075KL; Supplier 2: Digi-Key; Supplier Part Number 2: 13-RC0603FR-1075KLCT-ND; Manufacturer 3: UNI-ROYAL(Uniroyal Elec); Manufacturer Part Number 3: 0603WAF7502T5E; Supplier 3: LCSC; Supplier Part Number 3: C23242; JLC Type: Basic
R144 = 100R/0603: as R125 on sheet Output_Terminals; Part Number: 100R/0603; Package: 0603; Value: 100R; HelpURL: https://www.yageogroup.com/content/datasheet/asset/file/PYU-RC_GROUP_51_ROHS_L; Supplier 1: Digi-Key; Supplier Part Number 1: 13-RC0603FR-13100RLCT-ND; Manufacturer 2: YAGEO; Manufacturer Part Number 2: RC0603FR-10100RL; Supplier 2: Digi-Key; Supplier Part Number 2: 13-RC0603FR-10100RLCT-ND; Manufacturer 3: UNI-ROYAL(Uniroyal Elec); Manufacturer Part Number 3: 0603WAF1000T5E; Supplier 3: LCSC; Supplier Part Number 3: C22775
R145 = 110K/0603: RES SM 0603 110K; Manufacturer: GENERIC; Manufacturer 1: YAGEO; Manufacturer Part Number 1: RC0603FR-13110KL; Absolute Value: 110000; Eurocircuits GPN: GPR0603110K; Part Number: 110K/0603; Package: 0603; Value: 110K; HelpURL: https://www.yageogroup.com/content/datasheet/asset/file/PYU-RC_GROUP_51_ROHS_L; Supplier 1: Digi-Key; Supplier Part Number 1: 13-RC0603FR-13110KLCT-ND; Manufacturer 2: YAGEO; Manufacturer Part Number 2: RC0603FR-07110KL; Supplier 2: Digi-Key; Supplier Part Number 2: 311-110KHRCT-ND; JLC Type: Extended; Manufacturer 3: UNI-ROYAL(Uniroyal Elec); Manufacturer Part Number 3: 0603WAF1103T5E; Supplier 3: LCSC; Supplier Part Number 3: C25805
R151 = 1K/0603: RES SM 0603 1K; Manufacturer: GENERIC; Manufacturer 1: YAGEO; Manufacturer Part Number 1: RC0603FR-131KL; Absolute Value: 1000; Eurocircuits GPN: GPR06031K; Part Number: 1K/0603; Package: 0603; Value: 1K; HelpURL: https://www.yageogroup.com/content/datasheet/asset/file/PYU-RC_GROUP_51_ROHS_L; Supplier 1: Digi-Key; Supplier Part Number 1: 13-RC0603FR-131KLCT-ND; Manufacturer 2: YAGEO; Manufacturer Part Number 2: RC0603FR-101KL; Supplier 2: Digi-Key; Supplier Part Number 2: 13-RC0603FR-101KLCT-ND; Manufacturer 3: UNI-ROYAL(Uniroyal Elec); Manufacturer Part Number 3: 0603WAF1001T5E; Supplier 3: LCSC; Supplier Part Number 3: C21190; JLC Type: Basic
R152 = 10K/0603/NTC/3380K: RES NTC SM 0603 10K; Manufacturer: GENERIC; Manufacturer 1: Murata; Manufacturer Part Number 1: NCU18XH103E60RB; Absolute Value: 10000; Eurocircuits GPN: GPR060310K; Part Number: 10K/0603/NTC/3380K; Package: 0603; Value: 10K; HelpURL: https://www.murata.com/en-us/api/pdfdownloadapi?cate=luNTCforTempeSenso&partno=NCU18XH103E60RB; Supplier 1: Digi-Key; Supplier Part Number 1: 490-18164-1-ND; Manufacturer 3: Sunlord; Manufacturer Part Number 3: SDNT1608X103F3380FTF; Supplier 3: LCSC; Supplier Part Number 3: C316397; JLC Type: Extended
U14 = OPA4197 TSSOP: OPA4197 36-V, Precision, Rail-to-Rail Input/Output, Low Offset Voltage, Operational Amplifiers; Manufacturer: Texas Instruments; Manufacturer Part Number 1: OPA4197IPWR; Part Number: OPA4197 TSSOP; Package: TSSOP-14; HelpURL: https://www.ti.com/lit/ds/symlink/opa197.pdf; Manufacturer 1: Texas Instruments; Supplier 1: Digi-Key; Supplier Part Number 1: 296-45060-1-ND; Manufacturer 3: Texas Instruments; Manufacturer Part Number 3: OPA4197IPWR; Supplier 3: LCSC; Supplier Part Number 3: C2057327; Manufacturer 2: Texas Instruments; Manufacturer Part Number 2: OPA4197QPWRQ1; Supplier 2: Digi-Key; Supplier Part Number 2: 296-OPA4197QPWRQ1CT-ND